# EAGLE design Main (EAGLE 9.6.2)
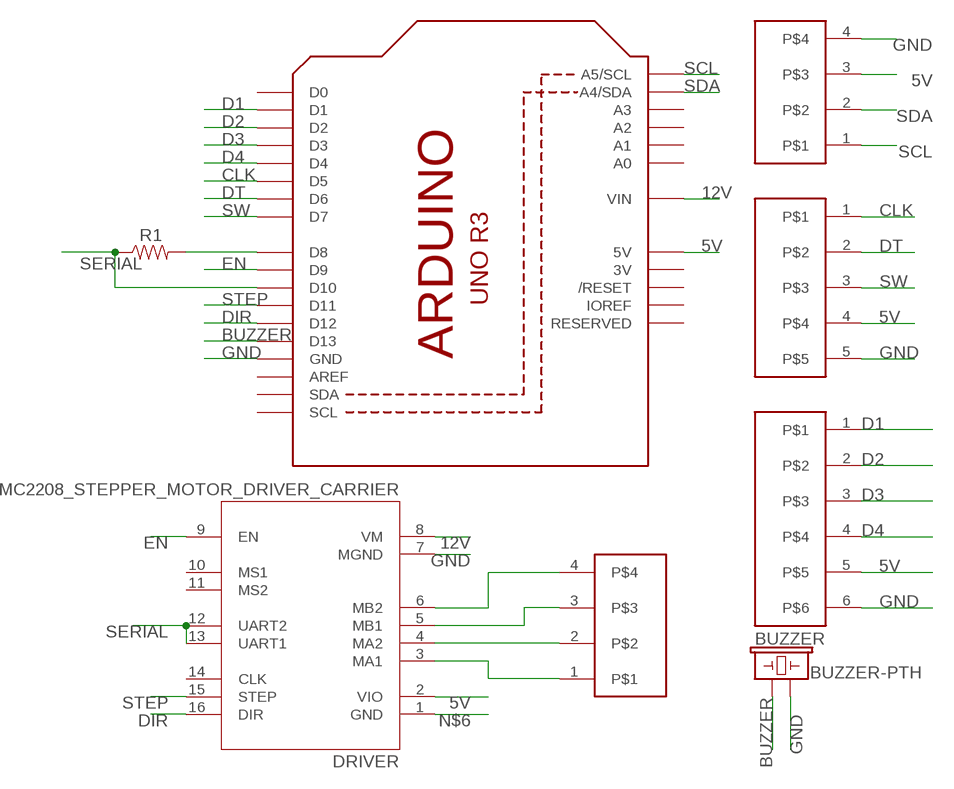
[diagram p0: schematic, sheet 1]

## Parts
BUZZER  BUZZER-PTH  [BUZZER-12MM]
DISPLAY  JST-XH-04-PIN-LONG-PAD  [JST-XH-04-PACKAGE-LONG-PAD]
DRIVER  IC_TMC2208_STEPPER_MOTOR_DRIVER_CARRIER  [IC_TMC2208_STEPPER_MOTOR_DRIVER_CARRIER]
ENCODER  JST-XH-05-PIN-LONG-PAD  [JST-XH-05-PACKAGE-LONG-PAD]
MOTOR  JST-XH-04-PIN-LONG-PAD  [JST-XH-04-PACKAGE-LONG-PAD]
OUTPUT  JST-XH-06-PIN-LONG-PAD  [JST-XH-06-PACKAGE-LONG-PAD]
R1  RESISTORAXIAL-0.3  [AXIAL-0.3]
U2  ARDUINOR3-BPLACE  [ARDUINOR3-BPLACE]

## Nets
5V: DISPLAY.3 DRIVER.2(VIO) ENCODER.4 OUTPUT.5 U2.5V
12V: DRIVER.8(VM) U2.VIN
BUZZER: BUZZER.+ U2.D13
CLK: ENCODER.1 U2.D5
D1: OUTPUT.1 U2.D1
D2: OUTPUT.2 U2.D2
D3: OUTPUT.3 U2.D3
D4: OUTPUT.4 U2.D4
DIR: DRIVER.16(DIR) U2.D12
DT: ENCODER.2 U2.D6
EN: DRIVER.9(EN) U2.D9
GND: BUZZER.- DISPLAY.4 DRIVER.7(MGND) ENCODER.5 OUTPUT.6 U2.GND U2.GND1(GND) U2.GND2(GND)
N$1: DRIVER.3(MA1) MOTOR.1
N$2: DRIVER.4(MA2) MOTOR.2
N$3: DRIVER.5(MB1) MOTOR.3
N$4: DRIVER.6(MB2) MOTOR.4
N$5: R1.P$2 U2.D8
N$6: DRIVER.1(GND)
SCL: DISPLAY.1 U2.A5(A5/SCL)
SDA: DISPLAY.2 U2.A4(A4/SDA)
SERIAL: DRIVER.12(UART2) DRIVER.13(UART1) R1.P$1 U2.D10
STEP: DRIVER.15(STEP) U2.D11
SW: ENCODER.3 U2.D7
Unconnected: DRIVER.10(MS1) DRIVER.11(MS2) DRIVER.14(CLK) U2.A0 U2.A1 U2.A2 U2.A3 U2.AREF U2.D0 U2.IOREF U2.RESERVED U2.RESET(/RESET) U2.SCL U2.SDA

## Power pins joined to a net without a drawn wire
3V: U2.3V

## Library data of the parts
BUZZER = COSE:BUZZER: Buzzer Small round buzzers that operate around the audible 2kHz range. You can use these as speakers to create simple music or user interfaces. Variant Overview: PTH - Mini Speaker - PC Mount 12mm 2.048kHz <https://www.sparkfun.com/products/7950> PTH_KIT - Mini Speaker - PC Mount 12mm 2.048kHz <https://www.sparkfun.com/products/7950> KIT simplifies soldering by adding stop mask to one side of the pads. PTH_NO_SILK - Mini Speaker - PC Mount 12mm 2.048kHz <https://www.sparkfun.com/products/7950> No silkscreen indicator of buzzer outline. PTH_KIT_NO_SILK - Mini Speaker - PC Mount 12mm 2.048kHz <https://www.sparkfun.com/products/7950> KIT package w/o silkscreen SMD - Buzzer Audio Magnetic (CCV-084B16) SMD buzzer used on, e.g. the LilyPad Buzzer <https://www.sparkfun.com/products/8463> and RFID USB Reader <https://www.sparkfun.com/products/9963>. SMD_KIT - Buzzer Audio Magnetic (CCV-084B16) SMD Buzzer with elongated pins to make soldering easier. Used on the SparkFun Simon Says - Surface Mount Soldering Kit <https://www.sparkfun.com/products/10935>.; PROD_ID: COMP-08253; SF_SKU: COM-07950
DISPLAY MOTOR = COSE:JST-XH-04-PIN: JST XH Connector 2 Pin Wire to board connector. Pitch: 2,54 mm, (0.100") Number of pins: 4 Created by Rembrandt Electronics www.rembrandtelectronics.com
DRIVER = COSE:IC_TMC2208_STEPPER_MOTOR_DRIVER_CARRIER: Stepper motor controler; IC: DRV8825; 1.5A; Uin mot: 8.2÷45V; AVAILABILITY: Unavailable; DESCRIPTION: Stepper motor controler; IC: DRV8825; 1.5A; Uin mot: 8.2÷45V; MF: Pololu; MP: DRV8825 STEPPER MOTOR DRIVER CARRIER; PACKAGE: None; PRICE: None
ENCODER = COSE:JST-XH-05-PIN: JST XH Connector 2 Pin Wire to board connector. Pitch: 2,54 mm, (0.100") Number of pins: 5 Created by Rembrandt Electronics www.rembrandtelectronics.com
OUTPUT = COSE_2:JST-XH-06-PIN: JST XH Connector 2 Pin Wire to board connector. Pitch: 2,54 mm, (0.100") Number of pins: 6 Created by Rembrandt Electronics www.rembrandtelectronics.com
R1 = COSE:RESISTOR: Generic Resistor Package
U2 = COSE_2:ARDUINOR3: This is a new object for the new Arduino R3 - with extra pins that you may want to use (such as IOref, and duplicated A4/A5

## Net classes
0 default: width 1.27 mm, clearance 0.508 mm

## Board
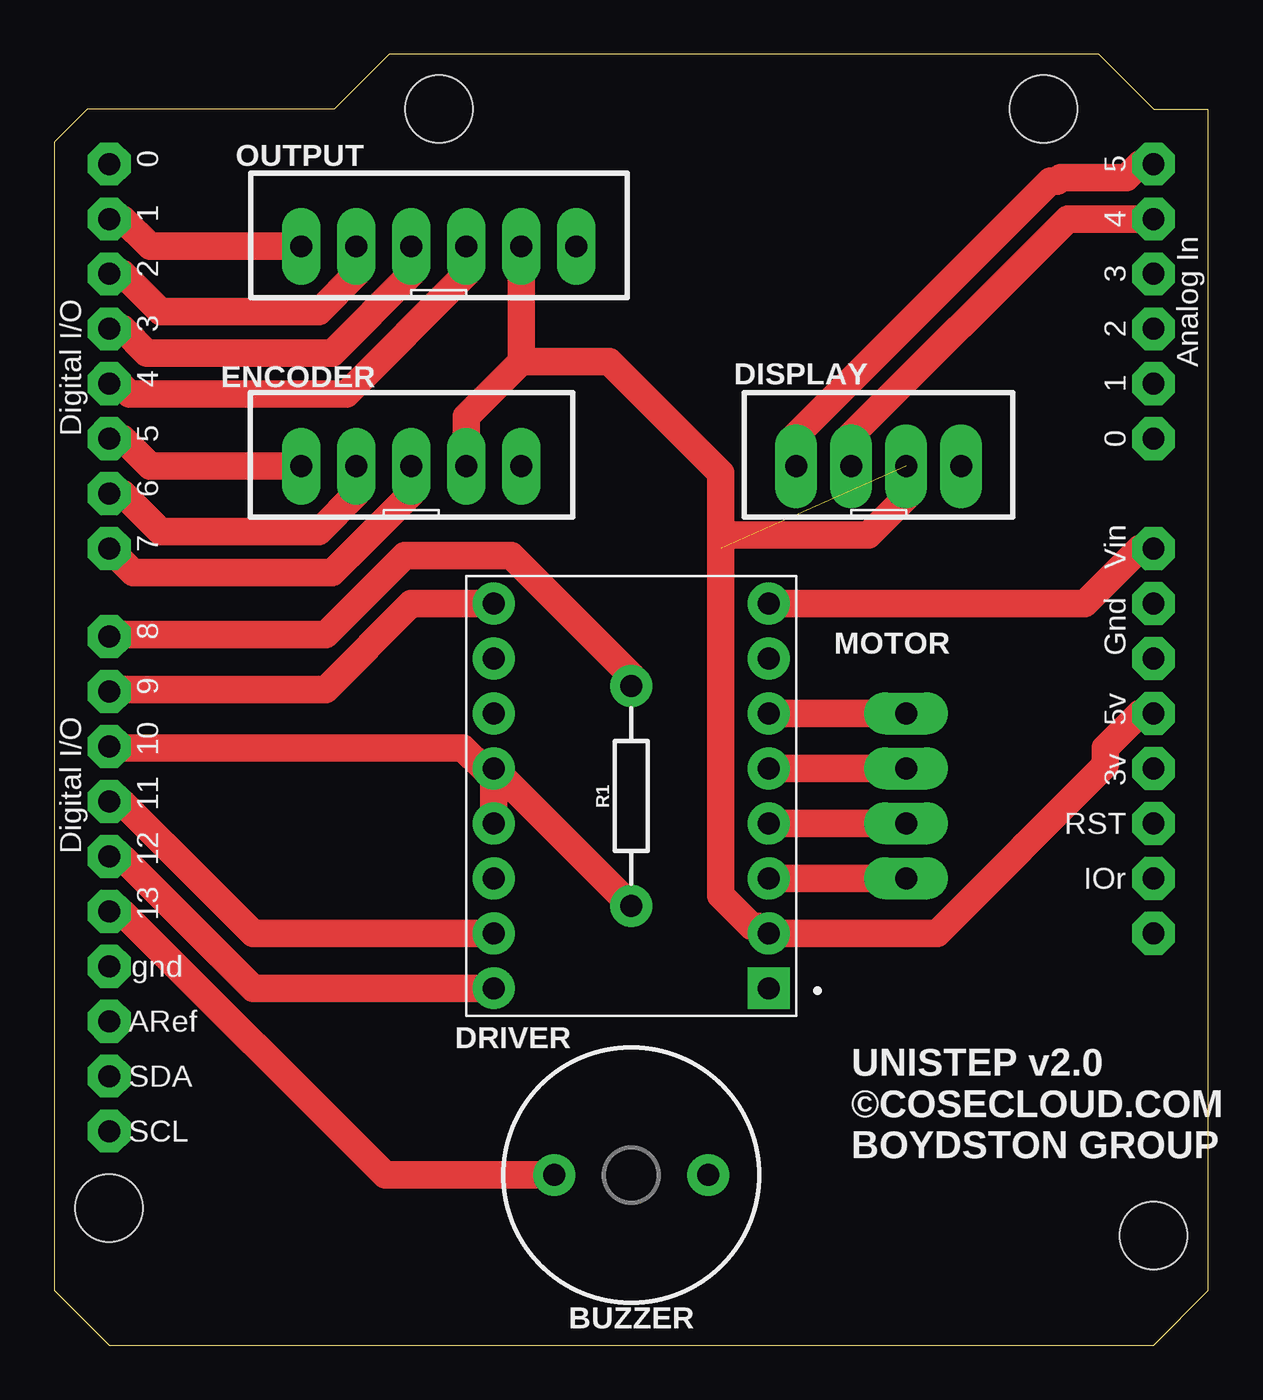
[diagram p1: board, top side]
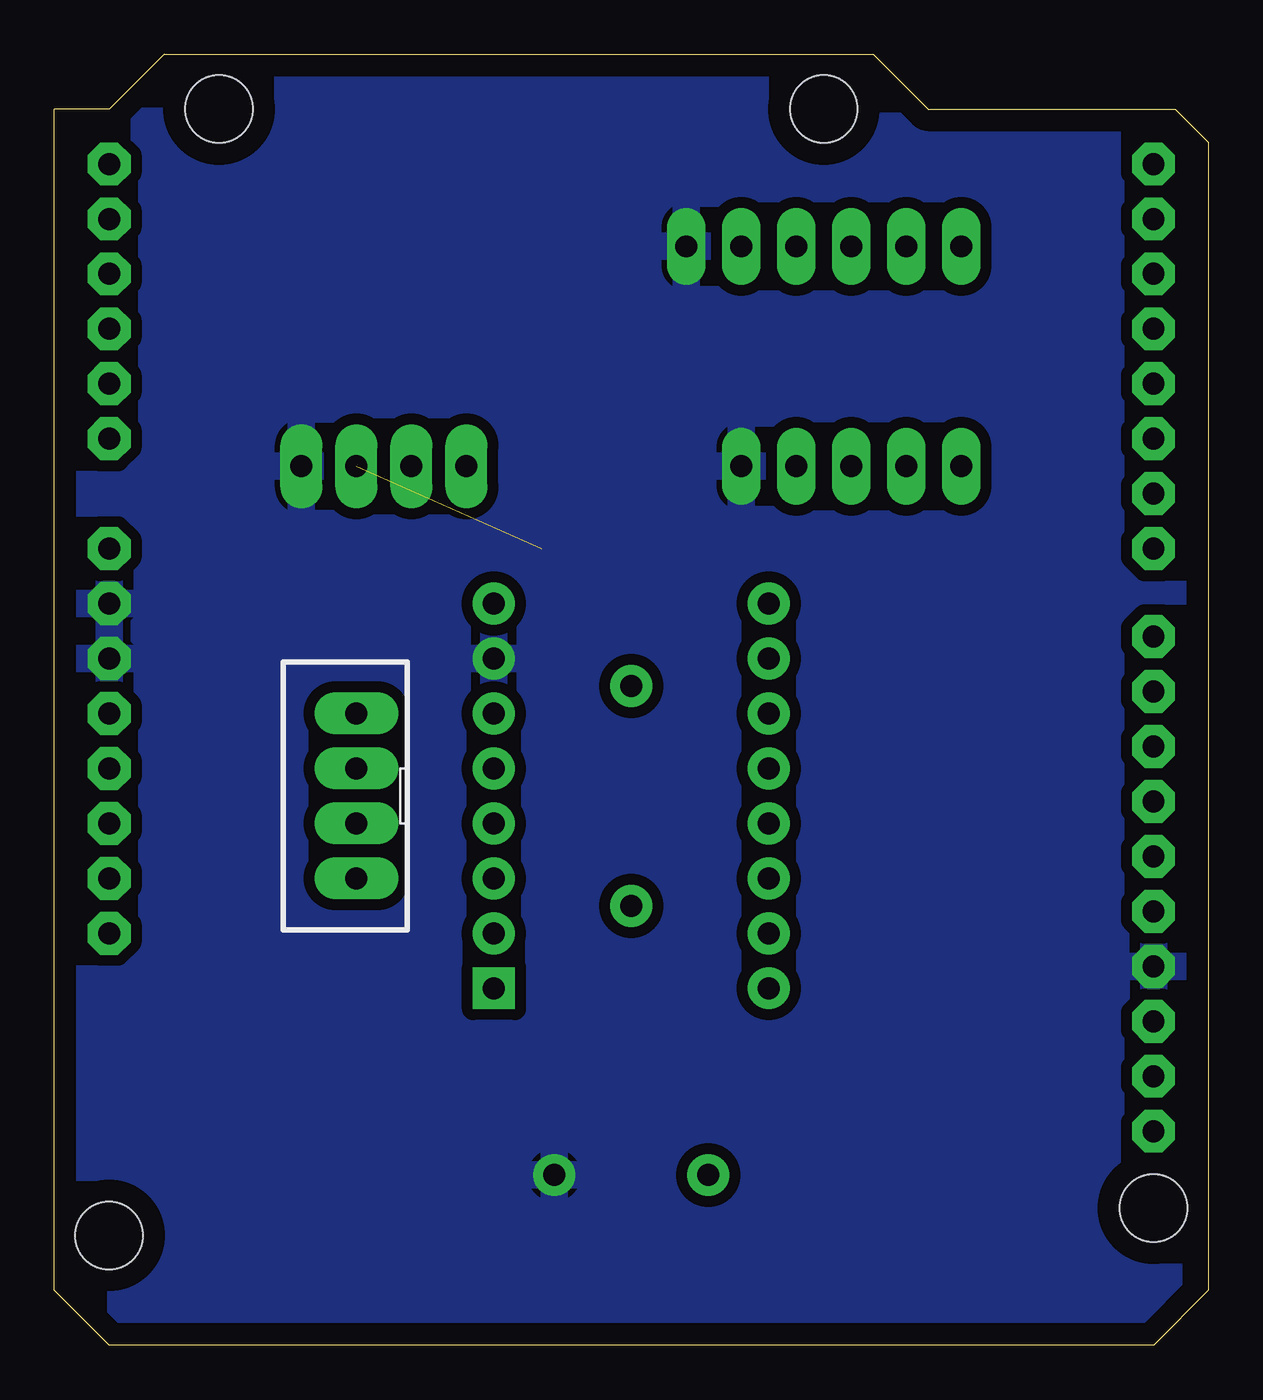
[diagram p2: board, bottom side, seen from below]

Size 53.34 x 59.69 mm. Coordinates in mm from the lower left corner, seen from the top.
Outline: 53.34,2.54 53.34,57.15 50.8,57.15 48.26,59.69 15.49,59.69 12.95,57.15 1.52,57.15 0,55.63 0,2.54 2.54,0 50.8,0 53.34,2.54
Copper layers (1*16): Top 0.035mm / dielectric 1.5mm / Bottom 0.035mm
Design rules "default": minimum track width 6mil, minimum drill 0.35mm, track to track 6mil, track to pad 6mil, pad to pad 6mil, via to via 6mil, smd to smd 6mil, copper to edge 40mil, drill to drill 6mil, minimum pad ring 10mil, minimum via ring 8mil, stop-mask expansion 4mil, vias tented up to drill 0mil, thermal gap 10mil

### Footprints (pad centres in the part's own frame; a part is rotated, then mirrored left to right if it is on the bottom)
BUZZER-12MM = drill 1.016 pad 1.93: + 3.556,0; - -3.556,0
JST-XH-04-PACKAGE-LONG-PAD = drill 1.016 pad 1.93 long: 1 -3.81,0; 2 -1.27,0; 3 1.27,0; 4 3.81,0
IC_TMC2208_STEPPER_MOTOR_DRIVER_CARRIER = drill 1.016 pad 1.93 square: 1 13.97,-19.05 | drill 1.016 pad 1.93: 2 13.97,-16.51; 3 13.97,-13.97; 4 13.97,-11.43; 5 13.97,-8.89; 6 13.97,-6.35; 7 13.97,-3.81; 8 13.97,-1.27; 9 1.27,-1.27; 10 1.27,-3.81; 11 1.27,-6.35; 12 1.27,-8.89; 13 1.27,-11.43; 14 1.27,-13.97; 15 1.27,-16.51; 16 1.27,-19.05
JST-XH-05-PACKAGE-LONG-PAD = drill 1.016 pad 1.778 long: 1 -5.08,0; 2 -2.54,0; 3 0,0; 4 2.54,0; 5 5.08,0
JST-XH-06-PACKAGE-LONG-PAD = drill 1.016 pad 1.778 long: 1 -6.35,0; 2 -3.81,0; 3 -1.27,0; 4 1.27,0; 5 3.81,0; 6 6.35,0
AXIAL-0.3 = drill 1.016 pad 1.93: P$1 -5.08,0; P$2 5.08,0
ARDUINOR3-BPLACE = drill 1.016 pad 1.981 octagon: 3V 35.56,2.54; 5V 38.1,2.54; A0 50.8,2.54; A1 53.34,2.54; A2 55.88,2.54; A3 58.42,2.54; A4 60.96,2.54; A5 63.5,2.54; AREF 23.876,50.8; D0 63.5,50.8; D1 60.96,50.8; D2 58.42,50.8; D3 55.88,50.8; D4 53.34,50.8; D5 50.8,50.8; D6 48.26,50.8; D7 45.72,50.8; D8 41.656,50.8; D9 39.116,50.8; D10 36.576,50.8; D11 34.036,50.8; D12 31.496,50.8; D13 28.956,50.8; GND 26.416,50.8; GND1 43.18,2.54; GND2 40.64,2.54; IOREF 30.48,2.54; RESERVED 27.94,2.54; RESET 33.02,2.54; SCL 18.796,50.8; SDA 21.336,50.8; VIN 45.72,2.54 | hole 3.1: 15.24,50.8; 13.97,2.54; 66.04,7.62; 66.04,35.56

### Placement (x,y rotation side)
BUZZER  26.67,7.87 180 top
DISPLAY  38.1,40.64 0 top
DRIVER  19.05,35.56 0 top
ENCODER  16.51,40.64 0 top
MOTOR  39.37,25.4 90 bottom
OUTPUT  17.78,50.8 0 top
R1  26.67,25.4 90 top
U2  53.34,-8.89 90 top

### Tracks (layer width: path | path; a pad name or v marks a point on that pad's centre or on a via)
5V  (1 unrouted)
  Top 1.27: U2.5V 50.16,29.21 48.58,27.62 48.58,26.83 40.8,19.05 DRIVER.2 32.54,19.37 32.23,19.37 30.8,20.8 30.8,37.47 37.62,37.47 39.37,39.21 DISPLAY.3 | ENCODER.4 19.05,42.93 21.59,45.47 | OUTPUT.5 21.59,45.47 | 21.59,45.47 25.65,45.47 30.8,40.32 30.8,36.83
12V
  Top 1.27: DRIVER.8 47.62,34.29 50.16,36.83 U2.VIN
BUZZER
  Top 1.27: BUZZER.+ 15.3,7.87 3.17,20 2.54,20 U2.D13
CLK
  Top 1.27: ENCODER.1 4.45,40.64 3.17,41.91 U2.D5
D1
  Top 1.27: OUTPUT.1 4.45,50.8 3.17,52.07 U2.D1
D2
  Top 1.27: OUTPUT.2 13.97,49.53 12.22,47.78 4.92,47.78 3.17,49.53 U2.D2
D3
  Top 1.27: OUTPUT.3 16.51,49.53 12.86,45.88 4.29,45.88 3.17,46.99 U2.D3
D4
  Top 1.27: OUTPUT.4 19.05,49.53 13.49,43.97 3.49,43.97 3.02,44.45 U2.D4
DIR
  Top 1.27: DRIVER.16 9.21,16.51 3.17,22.54 2.54,22.54 U2.D12
DT
  Top 1.27: ENCODER.2 13.97,39.37 12.22,37.62 4.92,37.62 3.17,39.37 U2.D6
EN
  Top 1.27: DRIVER.9 16.51,34.29 12.54,30.32 2.54,30.32 U2.D9
GND
  pour Bottom: -3.81,63.5 -3.81,-11.43 55.88,-11.43 55.88,63.5
N$1
  Top 1.27: MOTOR.1 DRIVER.3
N$2
  Top 1.27: MOTOR.2 DRIVER.4
N$3
  Top 1.27: MOTOR.3 DRIVER.5
N$4
  Top 1.27: MOTOR.4 DRIVER.6
N$5
  Top 1.27: R1.P$2 26.67,30.96 21.11,36.51 16.19,36.51 12.54,32.86 2.54,32.86 U2.D8
SCL
  Top 1.27: DISPLAY.1 34.29,42.07 46.04,53.82 46.35,53.82 46.51,53.98 49.53,53.98 50.16,54.61 U2.A5
SDA
  Top 1.27: DISPLAY.2 36.83,42.07 46.83,52.07 U2.A4
SERIAL
  Top 1.27: DRIVER.12 DRIVER.13 | DRIVER.12 R1.P$1 | U2.D10 2.54,27.62 18.89,27.62 19.84,26.67 DRIVER.12
STEP
  Top 1.27: DRIVER.15 9.21,19.05 3.17,25.08 2.54,25.08 U2.D11
SW
  Top 1.27: ENCODER.3 16.51,39.37 12.86,35.72 3.65,35.72 U2.D7

### Text on the board
tPlace: UNISTEP v2.0 / ©COSECLOUD.COM / BOYDSTON GROUP